# Altium schematic sheet TK525_Kraftforsyning.SchDoc: TK525 Kraftforsyning
size A3; Author: Øystein Smith; Organization: Omega Verksted; DocumentNumber: 16; Revision: 0; SheetNumber: 1; SheetTotal: 3
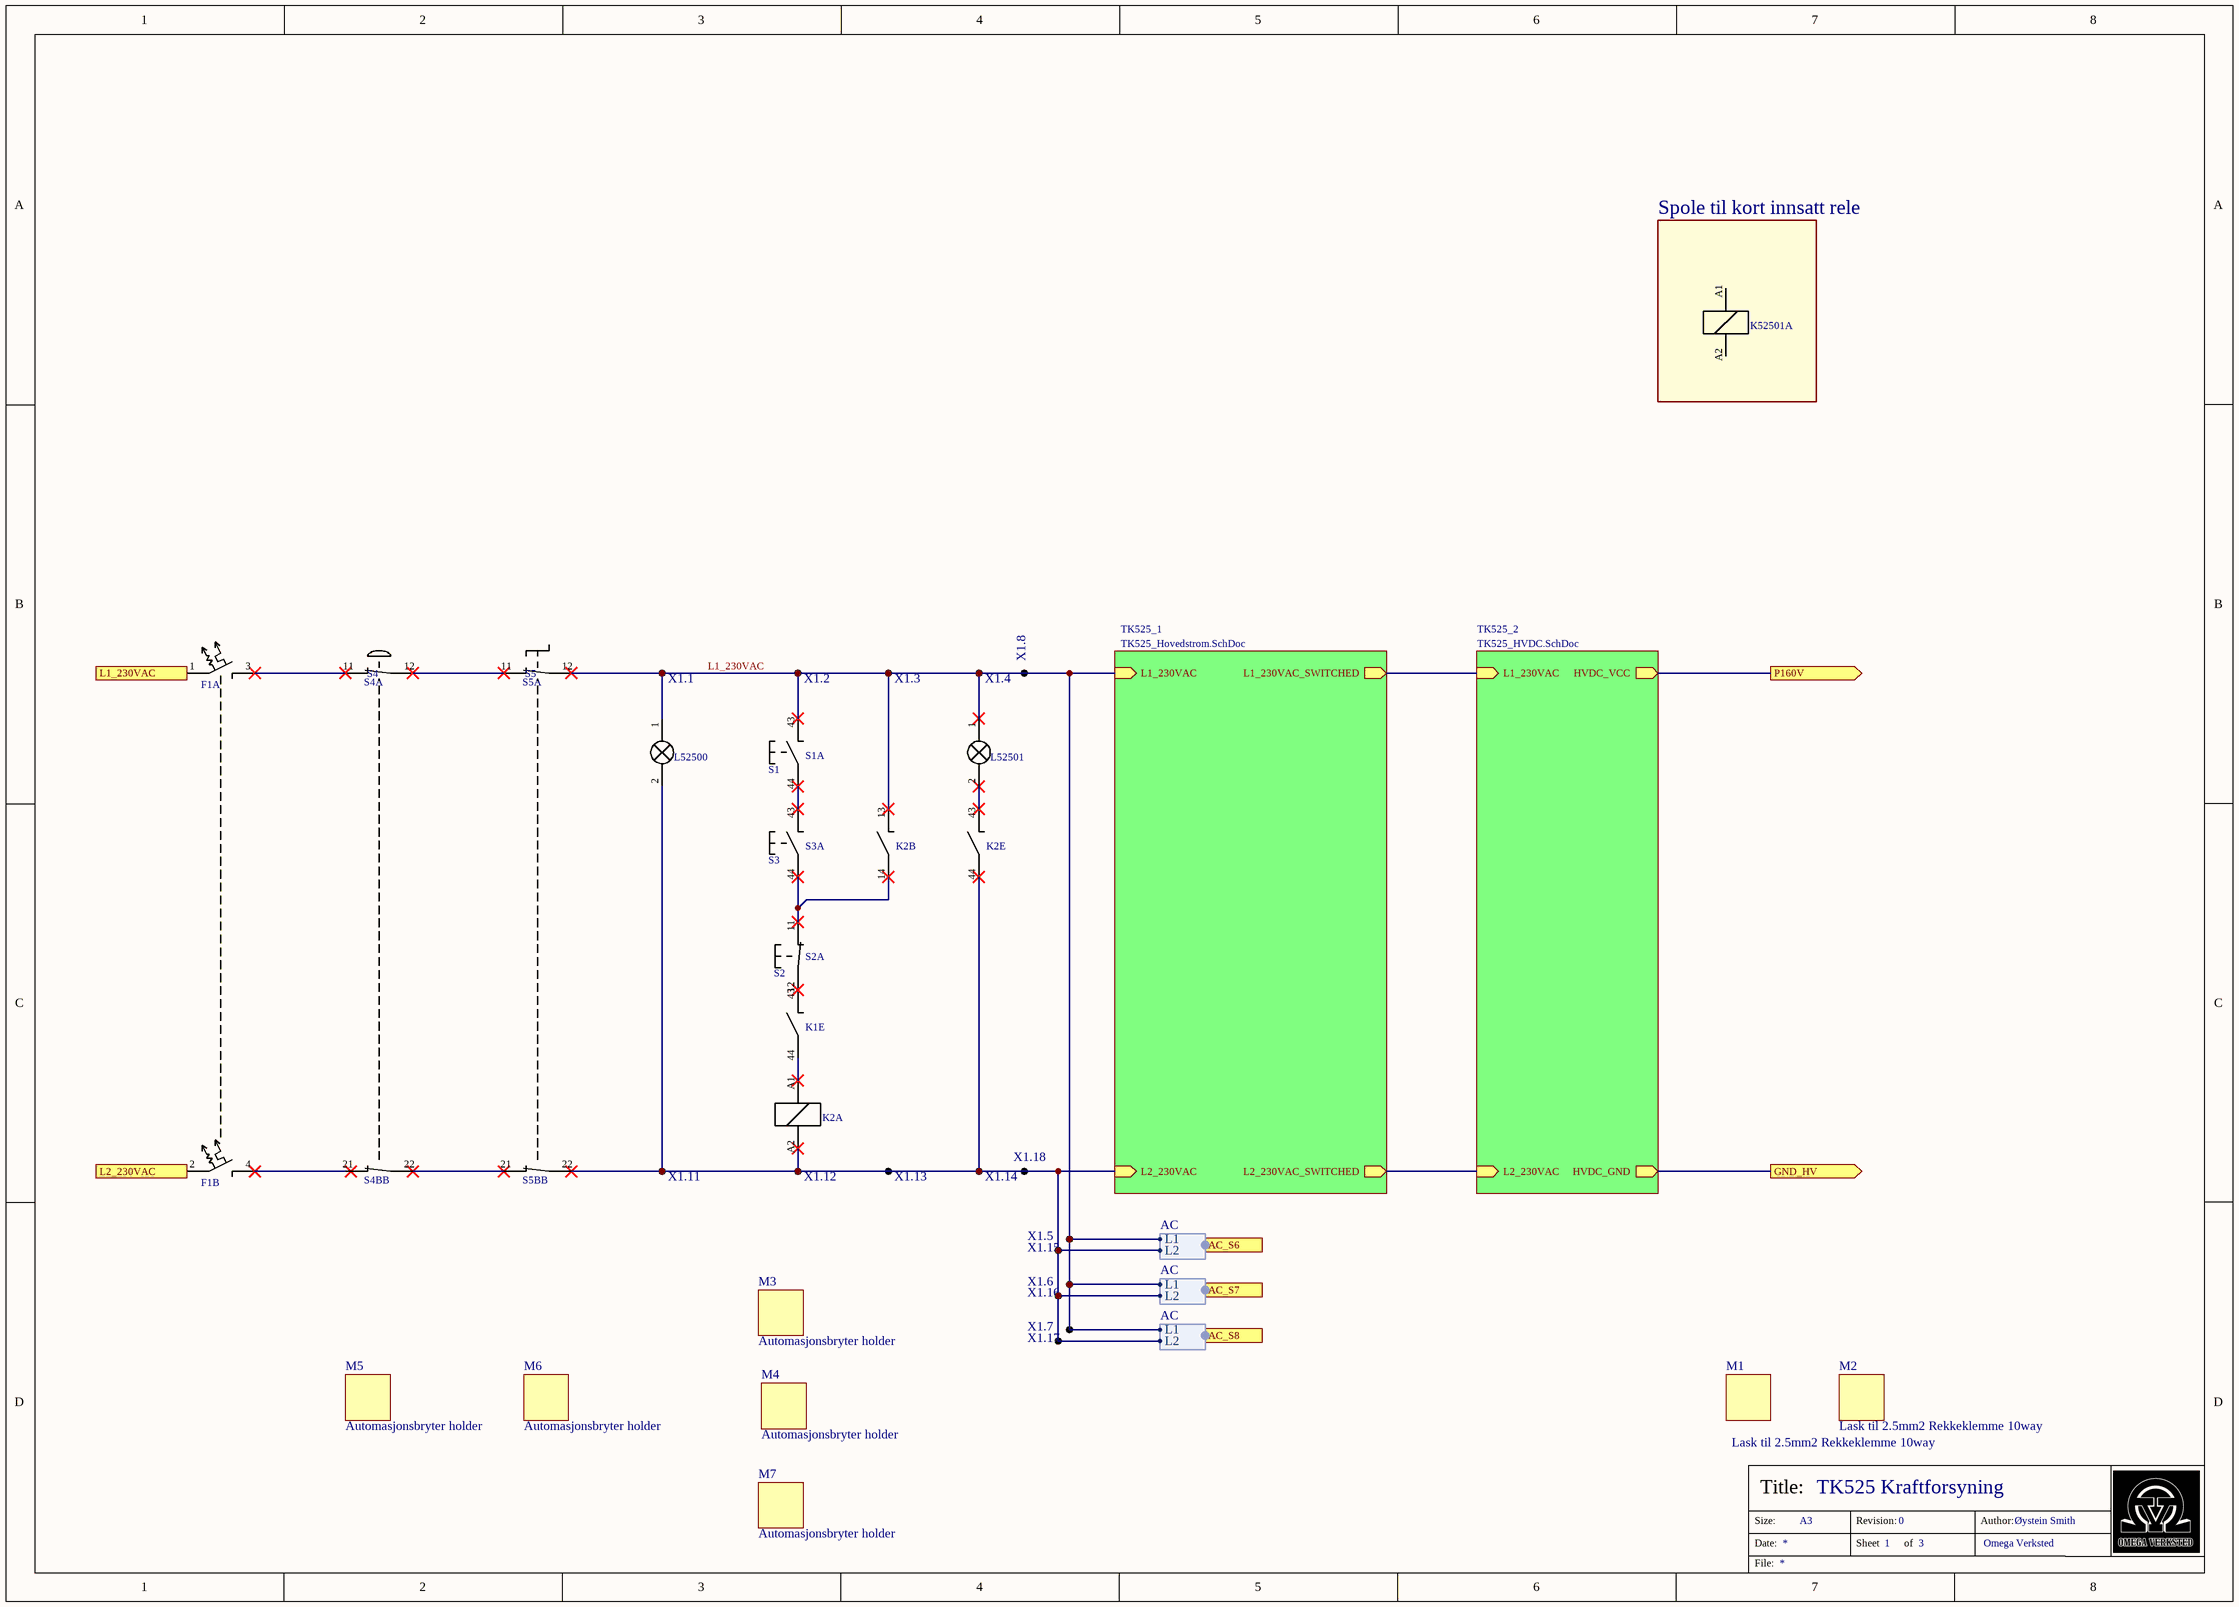
[diagram p0: TK525_Kraftforsyning.SchDoc]

## Parts
(Parts that share a designator on the sheet are numbered #1, #2 ... from top to bottom, then left to right.)
F1  Automatsikring  [dummy]  (value not drawn)  (parts A,B of 2)
K1  DIN-Rele 5V  [dummy]  (value not drawn)  (part E of 6)
K2  Kontaktor  [dummy]  (value not drawn)  (parts A,B,E of 6)
K52501  DIN-Rele 5V  [dummy]  (value not drawn)  (part A of 6)
L52500  Lampe  (value not drawn)
L52501  Lampe  (value not drawn)
M1  Lask til 2.5mm2 Rekkeklemme 10way  [dummy]
M2  Lask til 2.5mm2 Rekkeklemme 10way  [dummy]
M3  Automasjonsbryter holder  [dummy]
M4  Automasjonsbryter holder  [dummy]
M5  Automasjonsbryter holder  [dummy]
M6  Automasjonsbryter holder  [dummy]
M7  Automasjonsbryter holder  [dummy]
S1#1  Automasjonsbryter NO  [dummy]  (value not drawn)  (part A of 3)
S1#2  Automasjonsvelger Grønn  [dummy]  (value not drawn)
S2#1  Automasjonsbryter NC  [dummy]  (value not drawn)  (part A of 3)
S2#2  Automasjonsvelger Rød  [dummy]  (value not drawn)
S3#1  Automasjonsbryter NO  [dummy]  (value not drawn)  (part A of 3)
S3#2  Automasjonsvelger Grønn  [dummy]  (value not drawn)
S4#1  Automasjonsbryter NC  [dummy]  (value not drawn)  (part A of 3)
S4#2  Automasjonsvelger Nødstopp  [dummy]  (value not drawn)
S4B  Automasjonsbryter NC  [dummy]  (value not drawn)  (part B of 3)
S5#1  Automasjonsbryter NC  [dummy]  (value not drawn)  (part A of 3)
S5#2  Automasjonsvelger Vrider bistabil  [dummy]  (value not drawn)
S5B  Automasjonsbryter NC  [dummy]  (value not drawn)  (part B of 3)
X1.1  Rekkeklemme 2.5mm2  [dummy]  (value not drawn)
X1.2  Rekkeklemme 2.5mm2  [dummy]  (value not drawn)
X1.3  Rekkeklemme 2.5mm2  [dummy]  (value not drawn)
X1.4  Rekkeklemme 2.5mm2  [dummy]  (value not drawn)
X1.5  Rekkeklemme 2.5mm2  [dummy]  (value not drawn)
X1.6  Rekkeklemme 2.5mm2  [dummy]  (value not drawn)
X1.7  Rekkeklemme 2.5mm2  [dummy]  (value not drawn)
X1.8  Rekkeklemme 2.5mm2  [dummy]  (value not drawn)
X1.11  Rekkeklemme 2.5mm2  [dummy]  (value not drawn)
X1.12  Rekkeklemme 2.5mm2  [dummy]  (value not drawn)
X1.13  Rekkeklemme 2.5mm2  [dummy]  (value not drawn)
X1.14  Rekkeklemme 2.5mm2  [dummy]  (value not drawn)
X1.15  Rekkeklemme 2.5mm2  [dummy]  (value not drawn)
X1.16  Rekkeklemme 2.5mm2  [dummy]  (value not drawn)
X1.17  Rekkeklemme 2.5mm2  [dummy]  (value not drawn)
X1.18  Rekkeklemme 2.5mm2  [dummy]  (value not drawn)

## Blocks framed on the sheet
Spole til kort innsatt rele: K52501

## Sub-sheets
TK525_1 = TK525_Hovedstrom.SchDoc: L1_230VAC (in), L2_230VAC (in), L1_230VAC_SWITCHED (out), L2_230VAC_SWITCHED (out)
TK525_2 = TK525_HVDC.SchDoc: L2_230VAC (in), L1_230VAC (in), HVDC_GND (out), HVDC_VCC (out)

## Ports
AC_S6 (harness AC), AC_S7 (harness AC), AC_S8 (harness AC), GND_HV (out), L1_230VAC (in), L2_230VAC (in), P160V (out)

## Harnesses
AC: L1, L2

## Nets
GND_HV: port GND_HV, sheet TK525_2/HVDC_GND
L1_230VAC: K2.13 L52500.1 L52501.1 S1#1.43 S5#1.12 ; sheet TK525_1/L1_230VAC, port AC_S6.L1, port AC_S7.L1, port AC_S8.L1
L1_230VAC: F1.1 ; port L1_230VAC  [a separate net that carries the same name]
L2_230VAC: F1.2 ; port L2_230VAC
P160V: port P160V, sheet TK525_2/HVDC_VCC
NetF1_3: F1.3 S4#1.11
NetF1_4: F1.4 S4B.21
NetK1_43: K1.43 S2#1.12
NetK1_44: K1.44 K2.A1
NetK2_14: K2.14 S2#1.11 S3#1.44
NetK2_43: K2.43 L52501.2
NetK2_44: K2.44 K2.A2 L52500.2 S5B.22 ; sheet TK525_1/L2_230VAC, port AC_S6.L2, port AC_S7.L2, port AC_S8.L2
NetS1#1_44: S1#1.44 S3#1.43
NetS4#1_12: S4#1.12 S5#1.11
NetS4B_22: S4B.22 S5B.21
(unnamed): sheet TK525_1/L1_230VAC_SWITCHED, sheet TK525_2/L1_230VAC
(unnamed): sheet TK525_1/L2_230VAC_SWITCHED, sheet TK525_2/L2_230VAC

Not connected (* = marked no-connect by the designer): K52501 A1 A2

## Notes on the sheet
- Size:
- Date:
- Title:
- A3
- Revision:
- Sheet
- of
- Author:
- File:

## Library data of the parts
F1 = 2977: 2-Pol; id: 2977; symbol_opprettet_av: 815; leverandor_varenr: 2492800; pris: 362; nokkelord: Sikring, Fuse; produsent: ABB; leverandor: Farnell; pakketype: DIN; symbol_opprettet: 05/07/2015 13:21:53; navn: Automatsikring; pakke_opprettet_av: 815; pakke_opprettet: 02/11/2021 00:12:53
K1 K52501 = 3272: Coil: 5VDC, Contact: 250VAC 6A, DIN mount; id: 3272; symbol_opprettet_av: 815; leverandor_varenr: 1895933; pris: 310; produsent: ABB; leverandor: Farnell; symbol_opprettet: 04/07/2015 12:23:41; navn: DIN-Rele 5V; pakketype: -; pakke_opprettet_av: 815; pakke_opprettet: 02/11/2021 00:12:53
K2 = 2948: Industriellt rele; id: 2948; symbol_opprettet_av: 815; leverandor_varenr: 9940480; pris: 300; produsent: IMO; leverandor: Farnell; symbol_opprettet: 04/07/2015 12:23:41; navn: Kontaktor; nokkelord: Contactor; pakketype: -; pakke_opprettet_av: 815; pakke_opprettet: 02/11/2021 00:12:53
L52500 L52501 = 4773: Lampe, Generisk for skjema; id: 4773; symbol_opprettet_av: 815; pris: 0; symbol_opprettet: 05/07/2015 14:08:53; navn: Lampe; nokkelord: Lamp; pakketype: -
M1 M2 = 3273: Jumper (Busbar), Cross Jumper, DIN Rail Screw Clamp Terminal Blocks, 10 Ways; id: 3273; symbol_opprettet_av: 815; leverandor_varenr: 2061384; pris: 17; produsent: Multicomp; leverandor: Farnell; symbol_opprettet: 12/03/2017 01:13:28; navn: Lask til 2.5mm2 Rekkeklemme 10way; pakketype: -; pakke_opprettet_av: 815; pakke_opprettet: 02/11/2021 00:12:53
M3-M7 = 6258: Assembly Hardware, Siemens 3-Way Modules, Holder, SIRIUS ACT 3SU Series; id: 6258; symbol_opprettet_av: 815; leverandor_varenr: 2695729; pris: 34; nokkelord: bryter, switch, tesla; leverandor: Farnell; symbol_opprettet: 12/03/2017 01:13:28; navn: Automasjonsbryter holder; produsent: Siemens; pakke_opprettet_av: 815; pakke_opprettet: 02/11/2021 00:12:53
S1#1 S3#1 = 6257: Contact Block, SPST-NO, 10 A, 500 V, 1 Pole, 3SU Series, Screw; id: 6257; symbol_opprettet_av: 815; leverandor_varenr: 2695771; pris: 80; nokkelord: bryter, switch, tesla; produsent: Siemens; leverandor: Farnell; symbol_opprettet: 01/11/2021 23:46:02; navn: Automasjonsbryter NO; pakke_opprettet_av: 815; pakke_opprettet: 02/11/2021 00:12:53
S1#2 S3#2 = 6252: Switch Actuator, Siemens 22mm Pushbutton Switches; id: 6252; symbol_opprettet_av: 815; leverandor_varenr: 2695623; pris: 78; nokkelord: automasjonsbryter, siemens; leverandor: Farnell; symbol_opprettet: 01/11/2021 23:43:07; navn: Automasjonsvelger Grønn; produsent: Siemens; pakke_opprettet_av: 815; pakke_opprettet: 02/11/2021 00:12:53
S2#1 S4#1 S4B S5#1 S5B = 6256: Contact Block, SPST-NC, 10 A, 500 V, 1 Pole, 3SU Series, Screw; id: 6256; symbol_opprettet_av: 815; leverandor_varenr: 2695772; pris: 80; nokkelord: bryter, switch, tesla; produsent: Siemens; leverandor: Farnell; symbol_opprettet: 01/11/2021 23:45:21; navn: Automasjonsbryter NC; pakke_opprettet_av: 815; pakke_opprettet: 02/11/2021 00:12:53
S2#2 = 6253: Switch Actuator, Siemens 22mm Pushbutton Switches; id: 6253; symbol_opprettet_av: 815; leverandor_varenr: 2695622; pris: 78; nokkelord: automasjonsbryter, siemens; leverandor: Farnell; symbol_opprettet: 01/11/2021 23:43:07; navn: Automasjonsvelger Rød; produsent: Siemens; pakke_opprettet_av: 815; pakke_opprettet: 02/11/2021 00:12:53
S4#2 = 6255: Switch Actuator, Siemens 22mm Emergency Stop Mushroom Pushbutton Switches; id: 6255; symbol_opprettet_av: 815; leverandor_varenr: 2695631; pris: 355; nokkelord: automasjonsbryter, siemens; leverandor: Farnell; symbol_opprettet: 01/11/2021 23:41:57; navn: Automasjonsvelger Nødstopp; produsent: Siemens; pakke_opprettet_av: 815; pakke_opprettet: 02/11/2021 00:12:53
S5#2 = 6254: Switch Actuator, Siemens 22mm Selector Switches; id: 6254; symbol_opprettet_av: 815; leverandor_varenr: 2695653; pris: 168; nokkelord: automasjonsbryter, siemens; leverandor: Farnell; symbol_opprettet: 01/11/2021 23:44:13; navn: Automasjonsvelger Vrider bistabil; produsent: Siemens; pakke_opprettet_av: 815; pakke_opprettet: 02/11/2021 00:12:53
X1.1-X1.8 X1.11-X1.18 = 3304: DIN Rail mount terminal block; id: 3304; symbol_opprettet_av: 815; leverandor_varenr: 2061376; pris: 5; nokkelord: CDU2.5; produsent: Multicomp; leverandor: Farnell; komponenttype: 11; symbol_opprettet: 12/03/2017 00:15:42; navn: Rekkeklemme 2.5mm2; pakketype: -; pakke_opprettet_av: 815; pakke_opprettet: 02/11/2021 00:12:53